# Altium project ZYNQ-HS-DEV.PrjPcb (part 4 of 4)
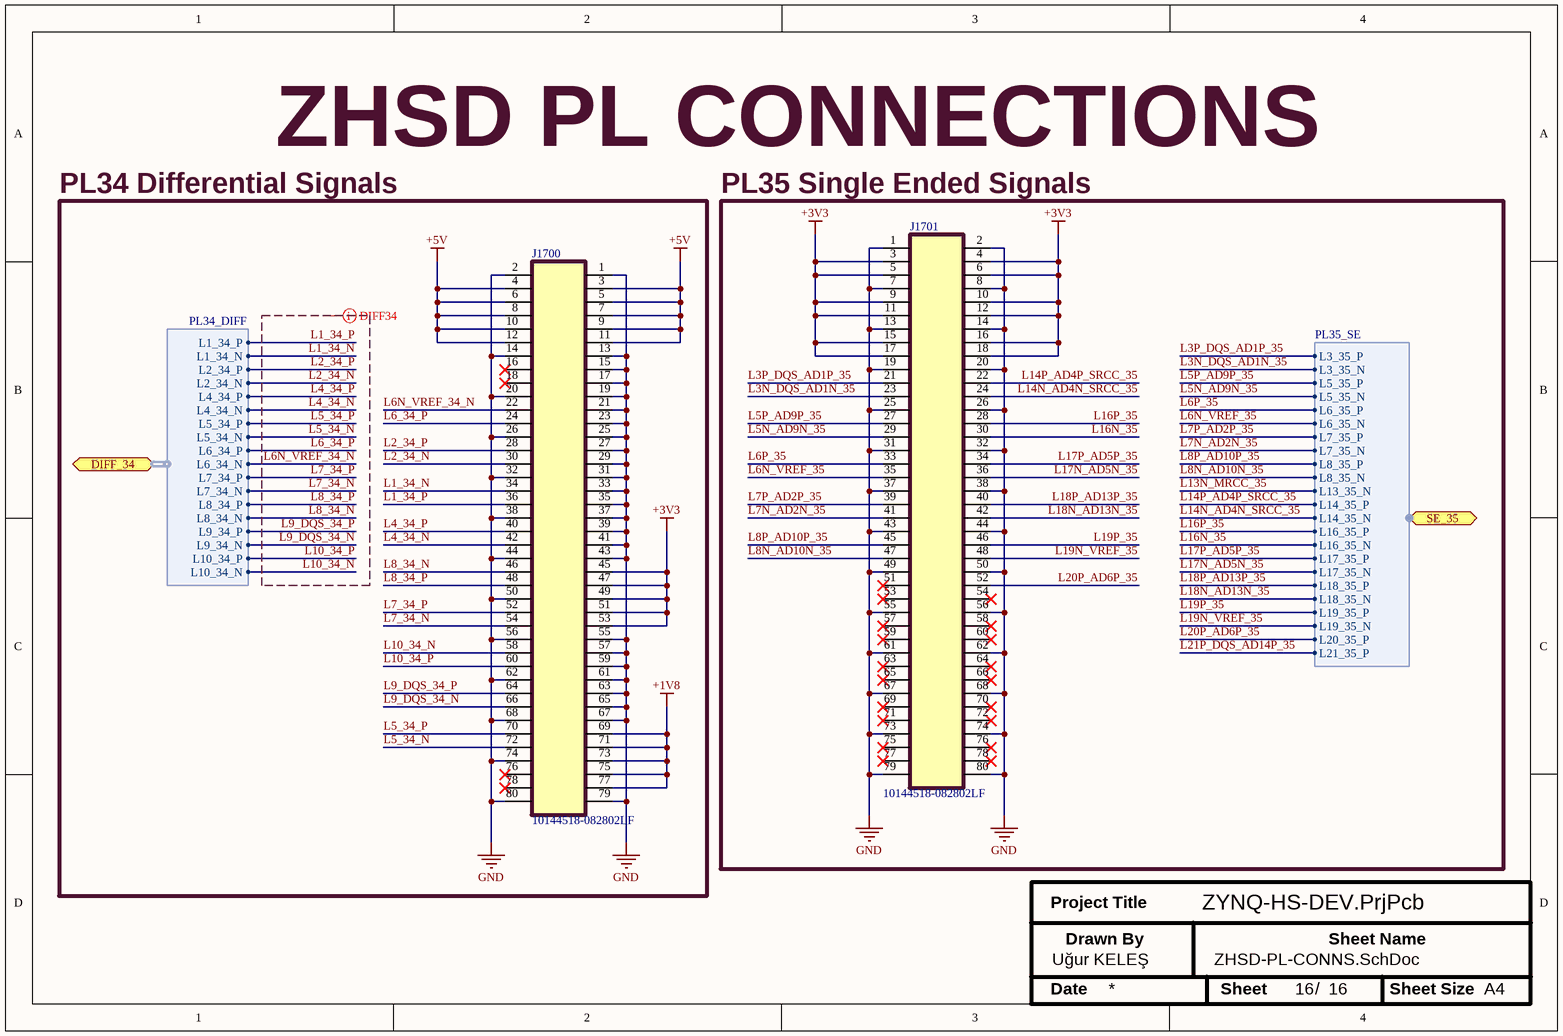
[diagram p16: ZHSD-PL-CONNS.SchDoc]

## Nets that join several sheets
+1V0: ZHSD-ZYNQ-PWR (32 pins), ZHSD-POWER (5 pins)
+1V8: ZHSD-ZYNQ-CONFIG (U300.F11 U300.J9), ZHSD-ZYNQ-PWR (25 pins), ZHSD-ZYNQ-MIO (10 pins), ZHSD-USB-OTG (8 pins), ZHSD-ETHERNET (C1110.2 C1111.2 FB1101.1), ZHSD-USB-UART (Q1200.1 Q1201.1 R1201.1 R1204.1), ZHSD-RS485-CAN (7 pins), ZHSD-HDMI (FB1501.1 FB1502.1 FB1503.1), ZHSD-POWER (5 pins), ZHSD-PL-CONNS (5 pins)
+1V35: ZHSD-ZYNQ-PWR (16 pins), ZHSD-ZYNQ-DDR (R625.2), ZHSD-DDR3L (76 pins), ZHSD-POWER (8 pins)
+3V3: ZHSD-ZYNQ-CONFIG (10 pins), ZHSD-JTAG (C516.2 J501.6), ZHSD-ZYNQ-PWR (44 pins), ZHSD-BOOT-STORAGE (34 pins), ZHSD-ZYNQ-MIO (9 pins), ZHSD-USB-OTG (9 pins), ZHSD-ETHERNET (13 pins), ZHSD-RS485-CAN (6 pins), ZHSD-ZYNQ-PL (7 pins), ZHSD-HDMI (8 pins), ZHSD-POWER (9 pins), ZHSD-PL-CONNS (17 pins)
+5V: ZHSD-USB-OTG (C1007.2 U1001.5), ZHSD-RS485-CAN (5 pins), ZHSD-HDMI (C1511.2 J1500.18 R1503.2 R1504.2), ZHSD-POWER (17 pins), ZHSD-PL-CONNS (10 pins)
CHASSIS: ZHSD-JTAG (J500.SH), ZHSD-ZYNQ-PWR (C357.2 R300.1), ZHSD-USB-OTG (J1000.SH), ZHSD-ETHERNET (J1100.SH), ZHSD-USB-UART (J1200.SH), ZHSD-HDMI (J1500.S1 J1500.S2 J1500.S3 J1500.S4)
GND: ZHSD-ZYNQ-CONFIG (10 pins), ZHSD-JTAG (39 pins), ZHSD-ZYNQ-PWR (118 pins), ZHSD-BOOT-STORAGE (31 pins), ZHSD-ZYNQ-MIO (19 pins), ZHSD-USB-OTG (20 pins), ZHSD-ETHERNET (27 pins), ZHSD-USB-UART (12 pins), ZHSD-RS485-CAN (13 pins), ZHSD-ZYNQ-PL (9 pins), ZHSD-HDMI (86 pins), ZHSD-ZYNQ-DDR (15 pins), ZHSD-DDR3L (86 pins), ZHSD-POWER (43 pins), ZHSD-PL-CONNS (66 pins)
VTT: ZHSD-ZYNQ-DDR (35 pins), ZHSD-POWER (C212.2 U203.3 U203.5)
VTT_REF: ZHSD-ZYNQ-DDR (C600.2 C601.2 U300.H6 U300.P6), ZHSD-DDR3L (6 pins), ZHSD-POWER (C213.2 U203.6)
3V3_PG: ZHSD-ZYNQ-MIO (C802.2 R801.1 U800.2), ZHSD-POWER (R211.2 U205.8)
DDR_A0: ZHSD-ZYNQ-DDR (R600.2 U300.N2), ZHSD-DDR3L (U700.N3 U701.N3)
DDR_A1: ZHSD-ZYNQ-DDR (R601.2 U300.K2), ZHSD-DDR3L (U700.P7 U701.P7)
DDR_A2: ZHSD-ZYNQ-DDR (R602.2 U300.M3), ZHSD-DDR3L (U700.P3 U701.P3)
DDR_A3: ZHSD-ZYNQ-DDR (R603.2 U300.K3), ZHSD-DDR3L (U700.N2 U701.N2)
DDR_A4: ZHSD-ZYNQ-DDR (R604.2 U300.M4), ZHSD-DDR3L (U700.P8 U701.P8)
DDR_A5: ZHSD-ZYNQ-DDR (R605.2 U300.L1), ZHSD-DDR3L (U700.P2 U701.P2)
DDR_A6: ZHSD-ZYNQ-DDR (R606.2 U300.L4), ZHSD-DDR3L (U700.R8 U701.R8)
DDR_A7: ZHSD-ZYNQ-DDR (R607.2 U300.K4), ZHSD-DDR3L (U700.R2 U701.R2)
DDR_A8: ZHSD-ZYNQ-DDR (R608.2 U300.K1), ZHSD-DDR3L (U700.T8 U701.T8)
DDR_A9: ZHSD-ZYNQ-DDR (R609.2 U300.J4), ZHSD-DDR3L (U700.R3 U701.R3)
DDR_A10: ZHSD-ZYNQ-DDR (R610.2 U300.F5), ZHSD-DDR3L (U700.L7 U701.L7)
DDR_A11: ZHSD-ZYNQ-DDR (R611.2 U300.G4), ZHSD-DDR3L (U700.R7 U701.R7)
DDR_A12: ZHSD-ZYNQ-DDR (R612.2 U300.E4), ZHSD-DDR3L (U700.N7 U701.N7)
DDR_A13: ZHSD-ZYNQ-DDR (R613.2 U300.D4), ZHSD-DDR3L (U700.T3 U701.T3)
DDR_A14: ZHSD-ZYNQ-DDR (R614.2 U300.F4), ZHSD-DDR3L (U700.T7 U701.T7)
DDR_BA0: ZHSD-ZYNQ-DDR (R615.2 U300.L5), ZHSD-DDR3L (U700.M2 U701.M2)
DDR_BA1: ZHSD-ZYNQ-DDR (R616.2 U300.R4), ZHSD-DDR3L (U700.N8 U701.N8)
DDR_BA2: ZHSD-ZYNQ-DDR (R617.2 U300.J5), ZHSD-DDR3L (U700.M3 U701.M3)
DDR_CAS_B: ZHSD-ZYNQ-DDR (R620.2 U300.P5), ZHSD-DDR3L (U700.K3 U701.K3)
DDR_CK_N: ZHSD-ZYNQ-DDR (R624.1 U300.M2), ZHSD-DDR3L (U700.K7 U701.K7)
DDR_CK_P: ZHSD-ZYNQ-DDR (R624.2 U300.L2), ZHSD-DDR3L (U700.J7 U701.J7)
DDR_CKE: ZHSD-ZYNQ-DDR (R623.2 U300.N3), ZHSD-DDR3L (U700.K9 U701.K9)
DDR_CS_B: ZHSD-ZYNQ-DDR (R618.2 U300.N1), ZHSD-DDR3L (U700.L2 U701.L2)
DDR_DM0: ZHSD-ZYNQ-DDR (U300.A1), ZHSD-DDR3L (U700.E7)
DDR_DM1: ZHSD-ZYNQ-DDR (U300.F1), ZHSD-DDR3L (U700.D3)
DDR_DM2: ZHSD-ZYNQ-DDR (U300.T1), ZHSD-DDR3L (U701.E7)
DDR_DM3: ZHSD-ZYNQ-DDR (U300.Y1), ZHSD-DDR3L (U701.D3)
DDR_DQ0: ZHSD-ZYNQ-DDR (U300.C3), ZHSD-DDR3L (U700.A3)
DDR_DQ1: ZHSD-ZYNQ-DDR (U300.B3), ZHSD-DDR3L (U700.A2)
DDR_DQ2: ZHSD-ZYNQ-DDR (U300.A2), ZHSD-DDR3L (U700.C3)
DDR_DQ3: ZHSD-ZYNQ-DDR (U300.A4), ZHSD-DDR3L (U700.C2)
DDR_DQ4: ZHSD-ZYNQ-DDR (U300.D3), ZHSD-DDR3L (U700.B8)
DDR_DQ5: ZHSD-ZYNQ-DDR (U300.D1), ZHSD-DDR3L (U700.C8)
DDR_DQ6: ZHSD-ZYNQ-DDR (U300.C1), ZHSD-DDR3L (U700.A7)
DDR_DQ7: ZHSD-ZYNQ-DDR (U300.E1), ZHSD-DDR3L (U700.D7)
DDR_DQ8: ZHSD-ZYNQ-DDR (U300.E2), ZHSD-DDR3L (U700.F2)
DDR_DQ9: ZHSD-ZYNQ-DDR (U300.E3), ZHSD-DDR3L (U700.H3)
DDR_DQ10: ZHSD-ZYNQ-DDR (U300.G3), ZHSD-DDR3L (U700.G2)
DDR_DQ11: ZHSD-ZYNQ-DDR (U300.H3), ZHSD-DDR3L (U700.F7)
DDR_DQ12: ZHSD-ZYNQ-DDR (U300.J3), ZHSD-DDR3L (U700.E3)
DDR_DQ13: ZHSD-ZYNQ-DDR (U300.H2), ZHSD-DDR3L (U700.H7)
DDR_DQ14: ZHSD-ZYNQ-DDR (U300.H1), ZHSD-DDR3L (U700.H8)
DDR_DQ15: ZHSD-ZYNQ-DDR (U300.J1), ZHSD-DDR3L (U700.F8)
DDR_DQ16: ZHSD-ZYNQ-DDR (U300.P1), ZHSD-DDR3L (U701.G2)
DDR_DQ17: ZHSD-ZYNQ-DDR (U300.P3), ZHSD-DDR3L (U701.H3)
DDR_DQ18: ZHSD-ZYNQ-DDR (U300.R3), ZHSD-DDR3L (U701.F2)
DDR_DQ19: ZHSD-ZYNQ-DDR (U300.R1), ZHSD-DDR3L (U701.E3)
DDR_DQ20: ZHSD-ZYNQ-DDR (U300.T4), ZHSD-DDR3L (U701.H7)
DDR_DQ21: ZHSD-ZYNQ-DDR (U300.U4), ZHSD-DDR3L (U701.H8)
DDR_DQ22: ZHSD-ZYNQ-DDR (U300.U2), ZHSD-DDR3L (U701.F7)
DDR_DQ23: ZHSD-ZYNQ-DDR (U300.U3), ZHSD-DDR3L (U701.F8)
DDR_DQ24: ZHSD-ZYNQ-DDR (U300.V1), ZHSD-DDR3L (U701.C2)
DDR_DQ25: ZHSD-ZYNQ-DDR (U300.Y3), ZHSD-DDR3L (U701.C8)
DDR_DQ26: ZHSD-ZYNQ-DDR (U300.W1), ZHSD-DDR3L (U701.A3)
DDR_DQ27: ZHSD-ZYNQ-DDR (U300.Y4), ZHSD-DDR3L (U701.B8)
DDR_DQ28: ZHSD-ZYNQ-DDR (U300.Y2), ZHSD-DDR3L (U701.C3)
DDR_DQ29: ZHSD-ZYNQ-DDR (U300.W3), ZHSD-DDR3L (U701.A7)
DDR_DQ30: ZHSD-ZYNQ-DDR (U300.V2), ZHSD-DDR3L (U701.A2)
DDR_DQ31: ZHSD-ZYNQ-DDR (U300.V3), ZHSD-DDR3L (U701.D7)
DDR_DQS0_N: ZHSD-ZYNQ-DDR (U300.B2), ZHSD-DDR3L (U700.B7)
DDR_DQS0_P: ZHSD-ZYNQ-DDR (U300.C2), ZHSD-DDR3L (U700.C7)
DDR_DQS1_N: ZHSD-ZYNQ-DDR (U300.F2), ZHSD-DDR3L (U700.G3)
DDR_DQS1_P: ZHSD-ZYNQ-DDR (U300.G2), ZHSD-DDR3L (U700.F3)
DDR_DQS2_N: ZHSD-ZYNQ-DDR (U300.T2), ZHSD-DDR3L (U701.G3)
DDR_DQS2_P: ZHSD-ZYNQ-DDR (U300.R2), ZHSD-DDR3L (U701.F3)
DDR_DQS3_N: ZHSD-ZYNQ-DDR (U300.W4), ZHSD-DDR3L (U701.B7)
DDR_DQS3_P: ZHSD-ZYNQ-DDR (U300.W5), ZHSD-DDR3L (U701.C7)
DDR_DRST_B: ZHSD-ZYNQ-DDR (R626.2 U300.B4), ZHSD-DDR3L (U700.T2 U701.T2)
DDR_ODT: ZHSD-ZYNQ-DDR (R622.2 U300.N5), ZHSD-DDR3L (U700.K1 U701.K1)
DDR_RAS_B: ZHSD-ZYNQ-DDR (R619.2 U300.P4), ZHSD-DDR3L (U700.J3 U701.J3)
DDR_WE_B: ZHSD-ZYNQ-DDR (R621.2 U300.M5), ZHSD-DDR3L (U700.L3 U701.L3)
DIFF34.L1_34_N: ZHSD-ZYNQ-PL (U300.T10), ZHSD-PL-CONNS (J1700.34)
DIFF34.L1_34_P: ZHSD-ZYNQ-PL (U300.T11), ZHSD-PL-CONNS (J1700.36)
DIFF34.L2_34_N: ZHSD-ZYNQ-PL (U300.U12), ZHSD-PL-CONNS (J1700.30)
DIFF34.L2_34_P: ZHSD-ZYNQ-PL (U300.T12), ZHSD-PL-CONNS (J1700.28)
DIFF34.L4_34_N: ZHSD-ZYNQ-PL (U300.W13), ZHSD-PL-CONNS (J1700.42)
DIFF34.L4_34_P: ZHSD-ZYNQ-PL (U300.V12), ZHSD-PL-CONNS (J1700.40)
DIFF34.L5_34_N: ZHSD-ZYNQ-PL (U300.T15), ZHSD-PL-CONNS (J1700.72)
DIFF34.L5_34_P: ZHSD-ZYNQ-PL (U300.T14), ZHSD-PL-CONNS (J1700.70)
DIFF34.L6_34_N: ZHSD-ZYNQ-PL (U300.R14), ZHSD-PL-CONNS (J1700.22)
DIFF34.L6_34_P: ZHSD-ZYNQ-PL (U300.P14), ZHSD-PL-CONNS (J1700.24)
DIFF34.L7_34_N: ZHSD-ZYNQ-PL (U300.Y17), ZHSD-PL-CONNS (J1700.54)
DIFF34.L7_34_P: ZHSD-ZYNQ-PL (U300.Y16), ZHSD-PL-CONNS (J1700.52)
DIFF34.L8_34_N: ZHSD-ZYNQ-PL (U300.Y14), ZHSD-PL-CONNS (J1700.46)
DIFF34.L8_34_P: ZHSD-ZYNQ-PL (U300.W14), ZHSD-PL-CONNS (J1700.48)
DIFF34.L9_34_N: ZHSD-ZYNQ-PL (U300.U17), ZHSD-PL-CONNS (J1700.66)
DIFF34.L9_34_P: ZHSD-ZYNQ-PL (U300.T16), ZHSD-PL-CONNS (J1700.64)
DIFF34.L10_34_N: ZHSD-ZYNQ-PL (U300.W15), ZHSD-PL-CONNS (J1700.58)
DIFF34.L10_34_P: ZHSD-ZYNQ-PL (U300.V15), ZHSD-PL-CONNS (J1700.60)
ETH_MDC: ZHSD-ZYNQ-MIO (U300.C11), ZHSD-ETHERNET (U1100.13)
ETH_MDIO: ZHSD-ZYNQ-MIO (U300.C10), ZHSD-ETHERNET (R1113.1 U1100.14)
ETH_NINT: ZHSD-ZYNQ-MIO (U300.C17), ZHSD-ETHERNET (R1114.1 U1100.31)
ETH_PHY_NRST: ZHSD-ZYNQ-MIO (R805.1 U802.4), ZHSD-ETHERNET (U1100.12)
ETH_RX_CLK: ZHSD-ZYNQ-MIO (U300.B17), ZHSD-ETHERNET (R1109.2 R1110.2)
ETH_RX_CTL: ZHSD-ZYNQ-MIO (U300.D13), ZHSD-ETHERNET (R1108.2 R1111.2)
ETH_RXD0: ZHSD-ZYNQ-MIO (U300.D11), ZHSD-ETHERNET (R1100.1 R1104.2)
ETH_RXD1: ZHSD-ZYNQ-MIO (U300.A16), ZHSD-ETHERNET (R1101.1 R1105.2)
ETH_RXD2: ZHSD-ZYNQ-MIO (U300.F15), ZHSD-ETHERNET (R1102.1 R1106.2 R1112.2)
ETH_RXD3: ZHSD-ZYNQ-MIO (U300.A15), ZHSD-ETHERNET (R1103.1 R1107.2)
ETH_TX_CLK: ZHSD-ZYNQ-MIO (R811.1), ZHSD-ETHERNET (U1100.20)
ETH_TX_CTL: ZHSD-ZYNQ-MIO (R816.1), ZHSD-ETHERNET (U1100.19)
ETH_TXD0: ZHSD-ZYNQ-MIO (R812.1), ZHSD-ETHERNET (U1100.18)
ETH_TXD1: ZHSD-ZYNQ-MIO (R813.1), ZHSD-ETHERNET (U1100.17)
ETH_TXD2: ZHSD-ZYNQ-MIO (R814.1), ZHSD-ETHERNET (U1100.16)
ETH_TXD3: ZHSD-ZYNQ-MIO (R815.1), ZHSD-ETHERNET (U1100.15)
HDMI_CLK: ZHSD-ZYNQ-PL (U300.N17), ZHSD-HDMI (U1500.79)
HDMI_D0: ZHSD-ZYNQ-PL (U300.V16), ZHSD-HDMI (U1500.88)
HDMI_D1: ZHSD-ZYNQ-PL (U300.V17), ZHSD-HDMI (U1500.87)
HDMI_D2: ZHSD-ZYNQ-PL (U300.W16), ZHSD-HDMI (U1500.86)
HDMI_D3: ZHSD-ZYNQ-PL (U300.V18), ZHSD-HDMI (U1500.85)
HDMI_D4: ZHSD-ZYNQ-PL (U300.U18), ZHSD-HDMI (U1500.84)
HDMI_D5: ZHSD-ZYNQ-PL (U300.R17), ZHSD-HDMI (U1500.83)
HDMI_D6: ZHSD-ZYNQ-PL (U300.Y18), ZHSD-HDMI (U1500.82)
HDMI_D7: ZHSD-ZYNQ-PL (U300.W18), ZHSD-HDMI (U1500.81)
HDMI_D8: ZHSD-ZYNQ-PL (U300.P18), ZHSD-HDMI (U1500.80)
HDMI_D9: ZHSD-ZYNQ-PL (U300.Y19), ZHSD-HDMI (U1500.78)
HDMI_D10: ZHSD-ZYNQ-PL (U300.T20), ZHSD-HDMI (U1500.74)
HDMI_D11: ZHSD-ZYNQ-PL (U300.R18), ZHSD-HDMI (U1500.73)
HDMI_D12: ZHSD-ZYNQ-PL (U300.W20), ZHSD-HDMI (U1500.72)
HDMI_D13: ZHSD-ZYNQ-PL (U300.V20), ZHSD-HDMI (U1500.71)
HDMI_D14: ZHSD-ZYNQ-PL (U300.P19), ZHSD-HDMI (U1500.70)
HDMI_D15: ZHSD-ZYNQ-PL (U300.P20), ZHSD-HDMI (U1500.69)
HDMI_DE: ZHSD-ZYNQ-PL (U300.U15), ZHSD-HDMI (U1500.97)
HDMI_HSYNC: ZHSD-ZYNQ-PL (U300.T17), ZHSD-HDMI (U1500.98)
HDMI_I2C_SCL: ZHSD-ZYNQ-PL (U300.N20), ZHSD-HDMI (R1506.1 U1500.55)
HDMI_I2C_SDA: ZHSD-ZYNQ-PL (U300.N18), ZHSD-HDMI (R1507.1 U1500.56)
HDMI_INT: ZHSD-ZYNQ-PL (U300.U19), ZHSD-HDMI (R1508.1 U1500.45)
HDMI_SPDIF: ZHSD-ZYNQ-PL (U300.W19), ZHSD-HDMI (U1500.10)
HDMI_SPDIF_OUT: ZHSD-ZYNQ-PL (U300.U20), ZHSD-HDMI (U1500.46)
HDMI_VSYNC: ZHSD-ZYNQ-PL (U300.R16), ZHSD-HDMI (U1500.2)
OTG_CLK: ZHSD-ZYNQ-MIO (U300.A11), ZHSD-USB-OTG (U1000.1)
OTG_DATA0: ZHSD-ZYNQ-MIO (U300.A14), ZHSD-USB-OTG (U1000.3)
OTG_DATA1: ZHSD-ZYNQ-MIO (U300.D15), ZHSD-USB-OTG (U1000.4)
OTG_DATA2: ZHSD-ZYNQ-MIO (U300.A12), ZHSD-USB-OTG (U1000.5)
OTG_DATA3: ZHSD-ZYNQ-MIO (U300.F12), ZHSD-USB-OTG (U1000.6)
OTG_DATA4: ZHSD-ZYNQ-MIO (U300.C16), ZHSD-USB-OTG (U1000.7)
OTG_DATA5: ZHSD-ZYNQ-MIO (U300.A10), ZHSD-USB-OTG (U1000.9)
OTG_DATA6: ZHSD-ZYNQ-MIO (U300.E13), ZHSD-USB-OTG (U1000.10)
OTG_DATA7: ZHSD-ZYNQ-MIO (U300.C18), ZHSD-USB-OTG (U1000.13)
OTG_DIR: ZHSD-ZYNQ-MIO (U300.C13), ZHSD-USB-OTG (U1000.31)
OTG_NXT: ZHSD-ZYNQ-MIO (U300.E16), ZHSD-USB-OTG (U1000.2)
OTG_RST: ZHSD-ZYNQ-MIO (U300.D14), ZHSD-USB-OTG (R1001.1 U1000.27)
OTG_STP: ZHSD-ZYNQ-MIO (U300.C15), ZHSD-USB-OTG (U1000.29)
PL_CLK_125: ZHSD-ETHERNET (R1121.2), ZHSD-ZYNQ-PL (U300.K17)
PS_QSPI_IO0_M3: ZHSD-BOOT-STORAGE (R86.2 U16.5), ZHSD-ZYNQ-MIO (U300.B8)
PS_QSPI_IO1_M1: ZHSD-BOOT-STORAGE (R89.2 U16.2), ZHSD-ZYNQ-MIO (U300.D6)
PS_QSPI_IO2_M2: ZHSD-BOOT-STORAGE (R92.2 U16.3), ZHSD-ZYNQ-MIO (U300.B7)
PS_QSPI_IO3_M0: ZHSD-BOOT-STORAGE (R88.2 U16.7), ZHSD-ZYNQ-MIO (U300.A6)
PS_QSPI_SCK_M4: ZHSD-BOOT-STORAGE (R87.2 U16.6), ZHSD-ZYNQ-MIO (R806.1)
PS_QSPI_SS: ZHSD-BOOT-STORAGE (R96.1 U16.1), ZHSD-ZYNQ-MIO (U300.A7)
PS_SD_CLK: ZHSD-BOOT-STORAGE (R97.1 U17.M6), ZHSD-ZYNQ-MIO (R809.1)
PS_SD_CMD: ZHSD-BOOT-STORAGE (R98.1 U17.M5), ZHSD-ZYNQ-MIO (U300.C6)
PS_SD_IO0: ZHSD-BOOT-STORAGE (R102.1 U17.A3), ZHSD-ZYNQ-MIO (U300.E9)
PS_SD_IO1: ZHSD-BOOT-STORAGE (R101.1 U17.A4), ZHSD-ZYNQ-MIO (U300.E8)
PS_SD_IO2: ZHSD-BOOT-STORAGE (R100.1 U17.A5), ZHSD-ZYNQ-MIO (U300.C5)
PS_SD_IO3: ZHSD-BOOT-STORAGE (R99.1 U17.B2), ZHSD-ZYNQ-MIO (U300.C8)
RSCAN.CAN_RX: ZHSD-ZYNQ-MIO (U300.B15), ZHSD-RS485-CAN (U1301.B3)
RSCAN.CAN_STB: ZHSD-ZYNQ-MIO (U300.A9), ZHSD-RS485-CAN (U1301.C3)
RSCAN.CAN_TX: ZHSD-ZYNQ-MIO (U300.F13), ZHSD-RS485-CAN (U1301.A3)
RSCAN.RS485_DE: ZHSD-ZYNQ-MIO (U300.B5), ZHSD-RS485-CAN (U1302.2 U1302.3)
RSCAN.RS485_RX: ZHSD-ZYNQ-MIO (U300.D16), ZHSD-RS485-CAN (Q1300.2 R1302.2)
RSCAN.RS485_TX: ZHSD-ZYNQ-MIO (U300.B14), ZHSD-RS485-CAN (Q1301.2 R1306.2)
SD_RST: ZHSD-BOOT-STORAGE (R104.1), ZHSD-ZYNQ-MIO (Q800.3)
SE35.L3_35_N: ZHSD-ZYNQ-PL (U300.F19), ZHSD-PL-CONNS (J1701.23)
SE35.L3_35_P: ZHSD-ZYNQ-PL (U300.D19), ZHSD-PL-CONNS (J1701.21)
SE35.L5_35_N: ZHSD-ZYNQ-PL (U300.G20), ZHSD-PL-CONNS (J1701.29)
SE35.L5_35_P: ZHSD-ZYNQ-PL (U300.G19), ZHSD-PL-CONNS (J1701.27)
SE35.L6_35_N: ZHSD-ZYNQ-PL (U300.J18), ZHSD-PL-CONNS (J1701.35)
SE35.L6_35_P: ZHSD-ZYNQ-PL (U300.H17), ZHSD-PL-CONNS (J1701.33)
SE35.L7_35_N: ZHSD-ZYNQ-PL (U300.L20), ZHSD-PL-CONNS (J1701.41)
SE35.L7_35_P: ZHSD-ZYNQ-PL (U300.K19), ZHSD-PL-CONNS (J1701.39)
SE35.L8_35_N: ZHSD-ZYNQ-PL (U300.M18), ZHSD-PL-CONNS (J1701.47)
SE35.L8_35_P: ZHSD-ZYNQ-PL (U300.M19), ZHSD-PL-CONNS (J1701.45)
SE35.L14_35_N: ZHSD-ZYNQ-PL (U300.E19), ZHSD-PL-CONNS (J1701.24)
SE35.L14_35_P: ZHSD-ZYNQ-PL (U300.D18), ZHSD-PL-CONNS (J1701.22)
SE35.L16_35_N: ZHSD-ZYNQ-PL (U300.G18), ZHSD-PL-CONNS (J1701.30)
SE35.L16_35_P: ZHSD-ZYNQ-PL (U300.F17), ZHSD-PL-CONNS (J1701.28)
SE35.L17_35_N: ZHSD-ZYNQ-PL (U300.H20), ZHSD-PL-CONNS (J1701.36)
SE35.L17_35_P: ZHSD-ZYNQ-PL (U300.H18), ZHSD-PL-CONNS (J1701.34)
SE35.L18_35_N: ZHSD-ZYNQ-PL (U300.L19), ZHSD-PL-CONNS (J1701.42)
SE35.L18_35_P: ZHSD-ZYNQ-PL (U300.J20), ZHSD-PL-CONNS (J1701.40)
SE35.L19_35_N: ZHSD-ZYNQ-PL (U300.M17), ZHSD-PL-CONNS (J1701.48)
SE35.L19_35_P: ZHSD-ZYNQ-PL (U300.M20), ZHSD-PL-CONNS (J1701.46)
SE35.L20_35_P: ZHSD-ZYNQ-PL (U300.N16), ZHSD-PL-CONNS (J1701.52)
TCK_0: ZHSD-ZYNQ-CONFIG (R400.1 U300.J6), ZHSD-JTAG (R500.2 R505.1)
TDI_0: ZHSD-ZYNQ-CONFIG (U300.G6), ZHSD-JTAG (R502.2 R507.1)
TDO_0: ZHSD-ZYNQ-CONFIG (U300.F6), ZHSD-JTAG (R501.2 R506.1)
TMS_0: ZHSD-ZYNQ-CONFIG (R401.1 U300.F9), ZHSD-JTAG (R503.2 R509.1)
USB_UART_RX: ZHSD-ZYNQ-MIO (U300.C12), ZHSD-USB-UART (Q1200.2 R1201.2)
USB_UART_TX: ZHSD-ZYNQ-MIO (U300.B12), ZHSD-USB-UART (Q1201.2 R1204.2)